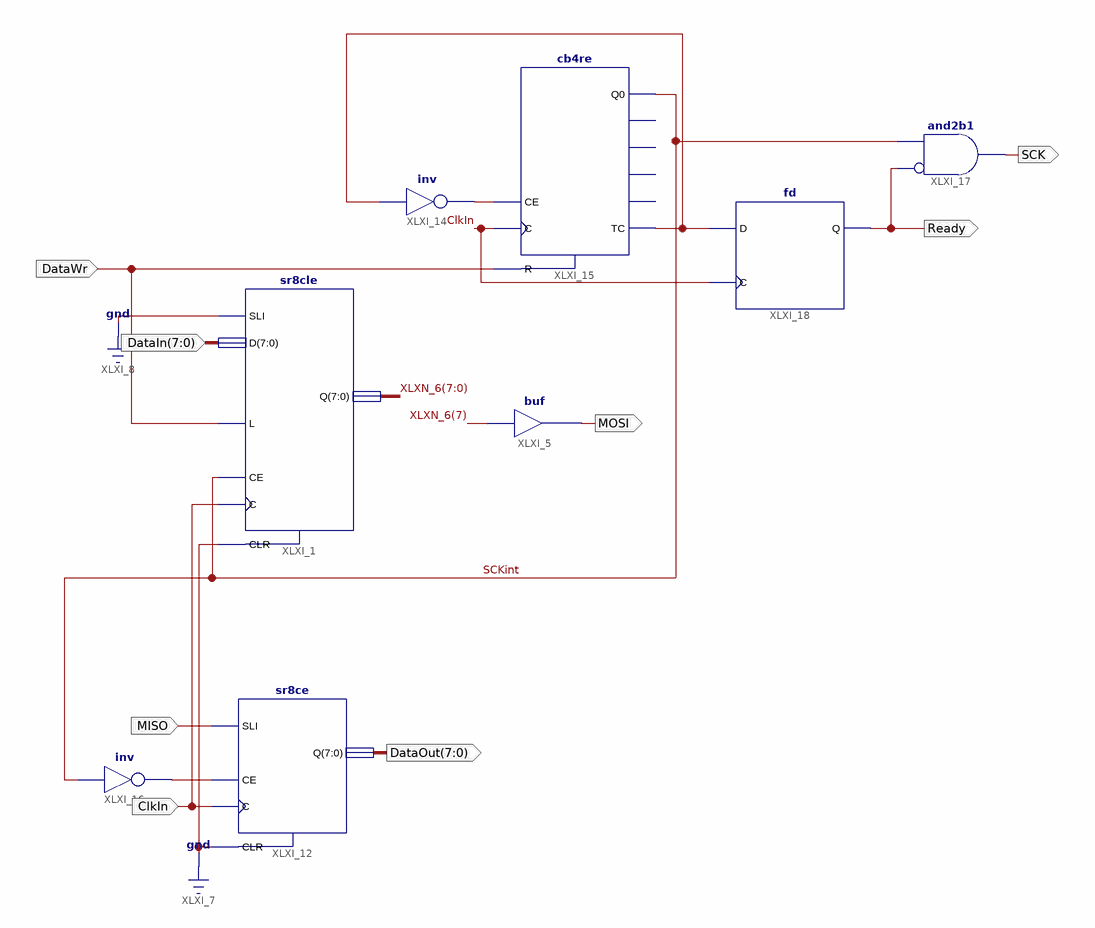
[diagram p0: schematic sheet 1]
// Xilinx ISE schematic SPIinterface.sch (spartan6) as structural Verilog: 8 symbols, 8 ports
module SPIinterface (
  input  [7:0] DataIn,
  input  ClkIn,
  input  MISO,
  input  DataWr,
  output [7:0] DataOut,
  output MOSI,
  output Ready,
  output SCK
);

  wire SCKint, XLXN_21, XLXN_22, XLXN_27;
  wire [7:0] XLXN_6;

  buf XLXI_5 (MOSI, XLXN_6[7]);
  sr8cle XLXI_1 (.C(ClkIn), .CE(SCKint), .CLR(1'b0), .D(DataIn), .L(DataWr), .SLI(1'b0), .Q(XLXN_6));
  sr8ce XLXI_12 (.C(ClkIn), .CE(XLXN_27), .CLR(1'b0), .SLI(MISO), .Q(DataOut));
  not XLXI_14 (XLXN_21, XLXN_22);
  cb4re #(.INIT("F")) XLXI_15 (
    .C(ClkIn), .CE(XLXN_21), .R(DataWr), .Q0(SCKint), .TC(XLXN_22));  // open: CEO, Q1, Q2, Q3
  not XLXI_16 (XLXN_27, SCKint);
  fd XLXI_18 (.C(ClkIn), .D(XLXN_22), .Q(Ready));
  and XLXI_17 (SCK, ~Ready, SCKint);  // and2b1
endmodule
